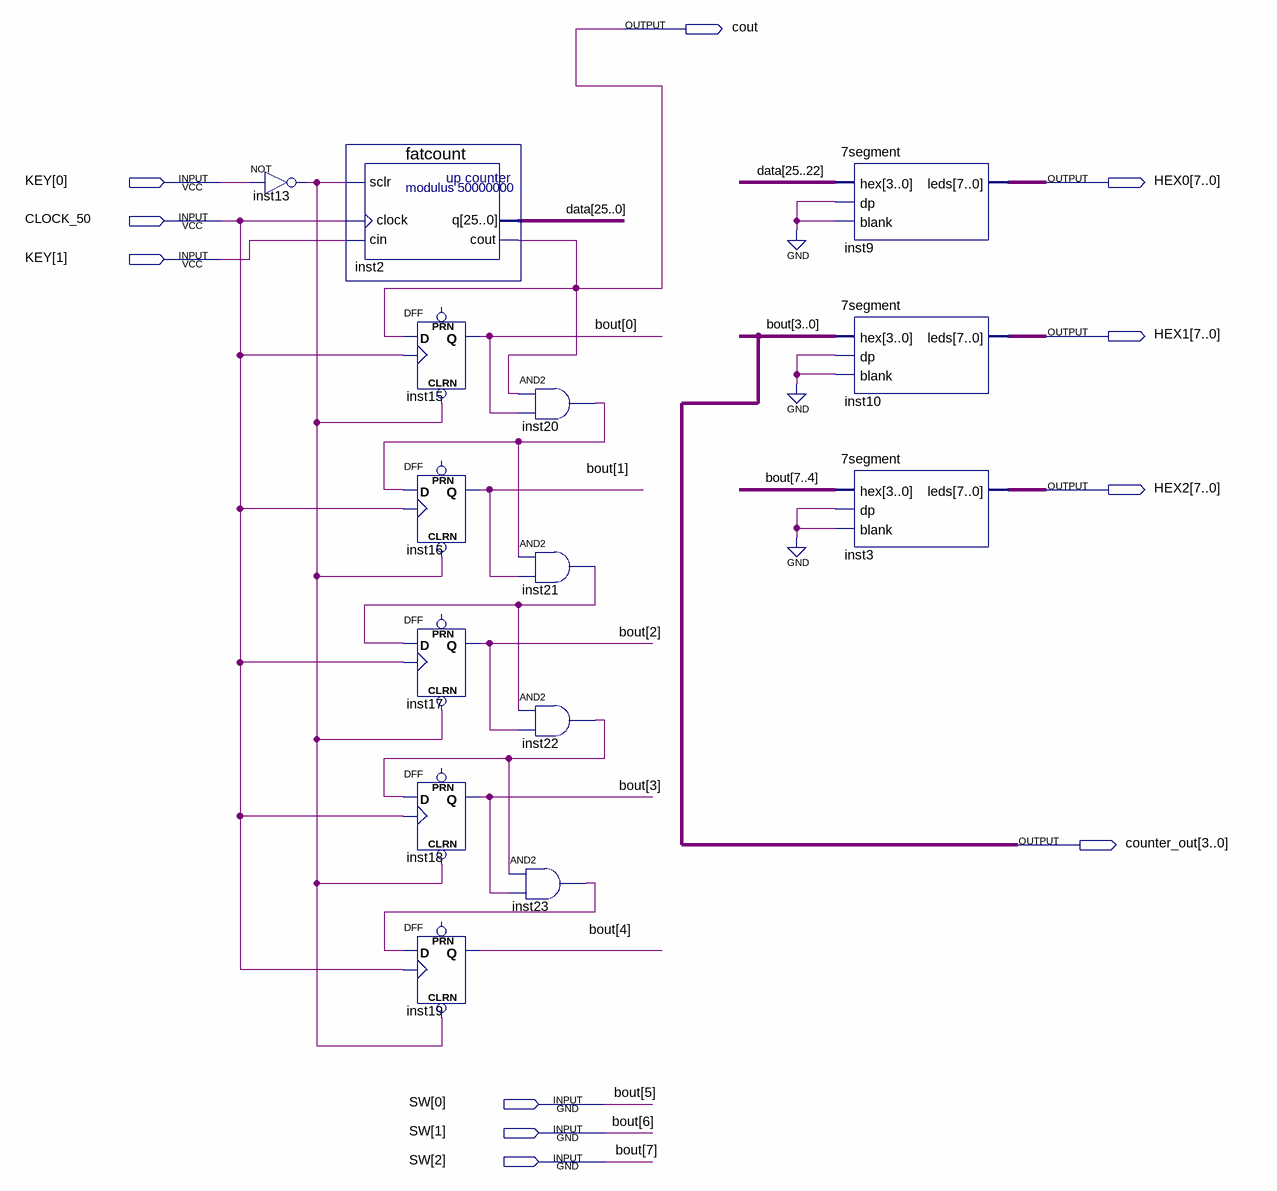
[diagram p0: schematic sheet]
// Quartus schematic Counter.bdf as structural Verilog: 14 symbols, 11 pins
module Counter (
  input  [1:0] KEY,
  input  CLOCK_50,
  input  [2:0] SW,
  output cout,
  output [7:0] HEX0,
  output [7:0] HEX1,
  output [7:0] HEX2,
  output [3:0] counter_out
);

  wire inst13_out, inst20_out, inst21_out, inst22_out, inst23_out;
  wire [4:4] bout;
  wire [25:0] data;

  not inst13 (inst13_out, KEY[0]);
  fatcount inst2 (.sclr(inst13_out), .clock(CLOCK_50), .cin(KEY[1]), .cout(cout), .q(data));
  DFF inst15 (.CLRN(inst13_out), .CLK(CLOCK_50), .D(cout), .Q(counter_out[0]));  // open: PRN
  DFF inst16 (.CLRN(inst13_out), .CLK(CLOCK_50), .D(inst20_out), .Q(counter_out[1]));  // open: PRN
  DFF inst17 (.CLRN(inst13_out), .CLK(CLOCK_50), .D(inst21_out), .Q(counter_out[2]));  // open: PRN
  DFF inst18 (.CLRN(inst13_out), .CLK(CLOCK_50), .D(inst22_out), .Q(counter_out[3]));  // open: PRN
  DFF inst19 (.CLRN(inst13_out), .CLK(CLOCK_50), .D(inst23_out), .Q(bout[4]));  // open: PRN
  and inst20 (inst20_out, cout, counter_out[0]);
  and inst21 (inst21_out, inst20_out, counter_out[1]);
  and inst22 (inst22_out, inst21_out, counter_out[2]);
  and inst23 (inst23_out, inst22_out, counter_out[3]);
  \7segment  inst9 (.hex(data[25:22]), .dp(1'b0), .blank(1'b0), .leds(HEX0));
  \7segment  inst10 (.hex(counter_out), .dp(1'b0), .blank(1'b0), .leds(HEX1));
  \7segment  inst3 (.hex({SW, bout[4]}), .dp(1'b0), .blank(1'b0), .leds(HEX2));

  // Other names for the same wires on the sheet: bout (some bits) = {SW, counter_out}
endmodule
